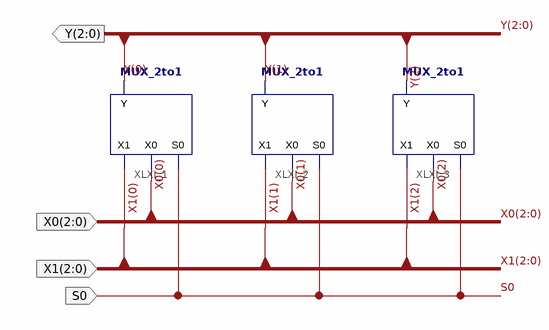
[diagram p0: schematic sheet 1]
// Xilinx ISE schematic Mux_2way_3bit.sch (spartan3e) as structural Verilog: 3 symbols, 4 ports
module Mux_2way_3bit (
  input  [2:0] X1,
  input  [2:0] X0,
  input  S0,
  output [2:0] Y
);

  MUX_2to1 XLXI_1 (.S0(S0), .X0(X0[0]), .X1(X1[0]), .Y(Y[0]));
  MUX_2to1 XLXI_2 (.S0(S0), .X0(X0[1]), .X1(X1[1]), .Y(Y[1]));
  MUX_2to1 XLXI_3 (.S0(S0), .X0(X0[2]), .X1(X1[2]), .Y(Y[2]));
endmodule
